# EAGLE design module_Rn_reg (EAGLE 6.5.0)

## Sheet 1 of 6
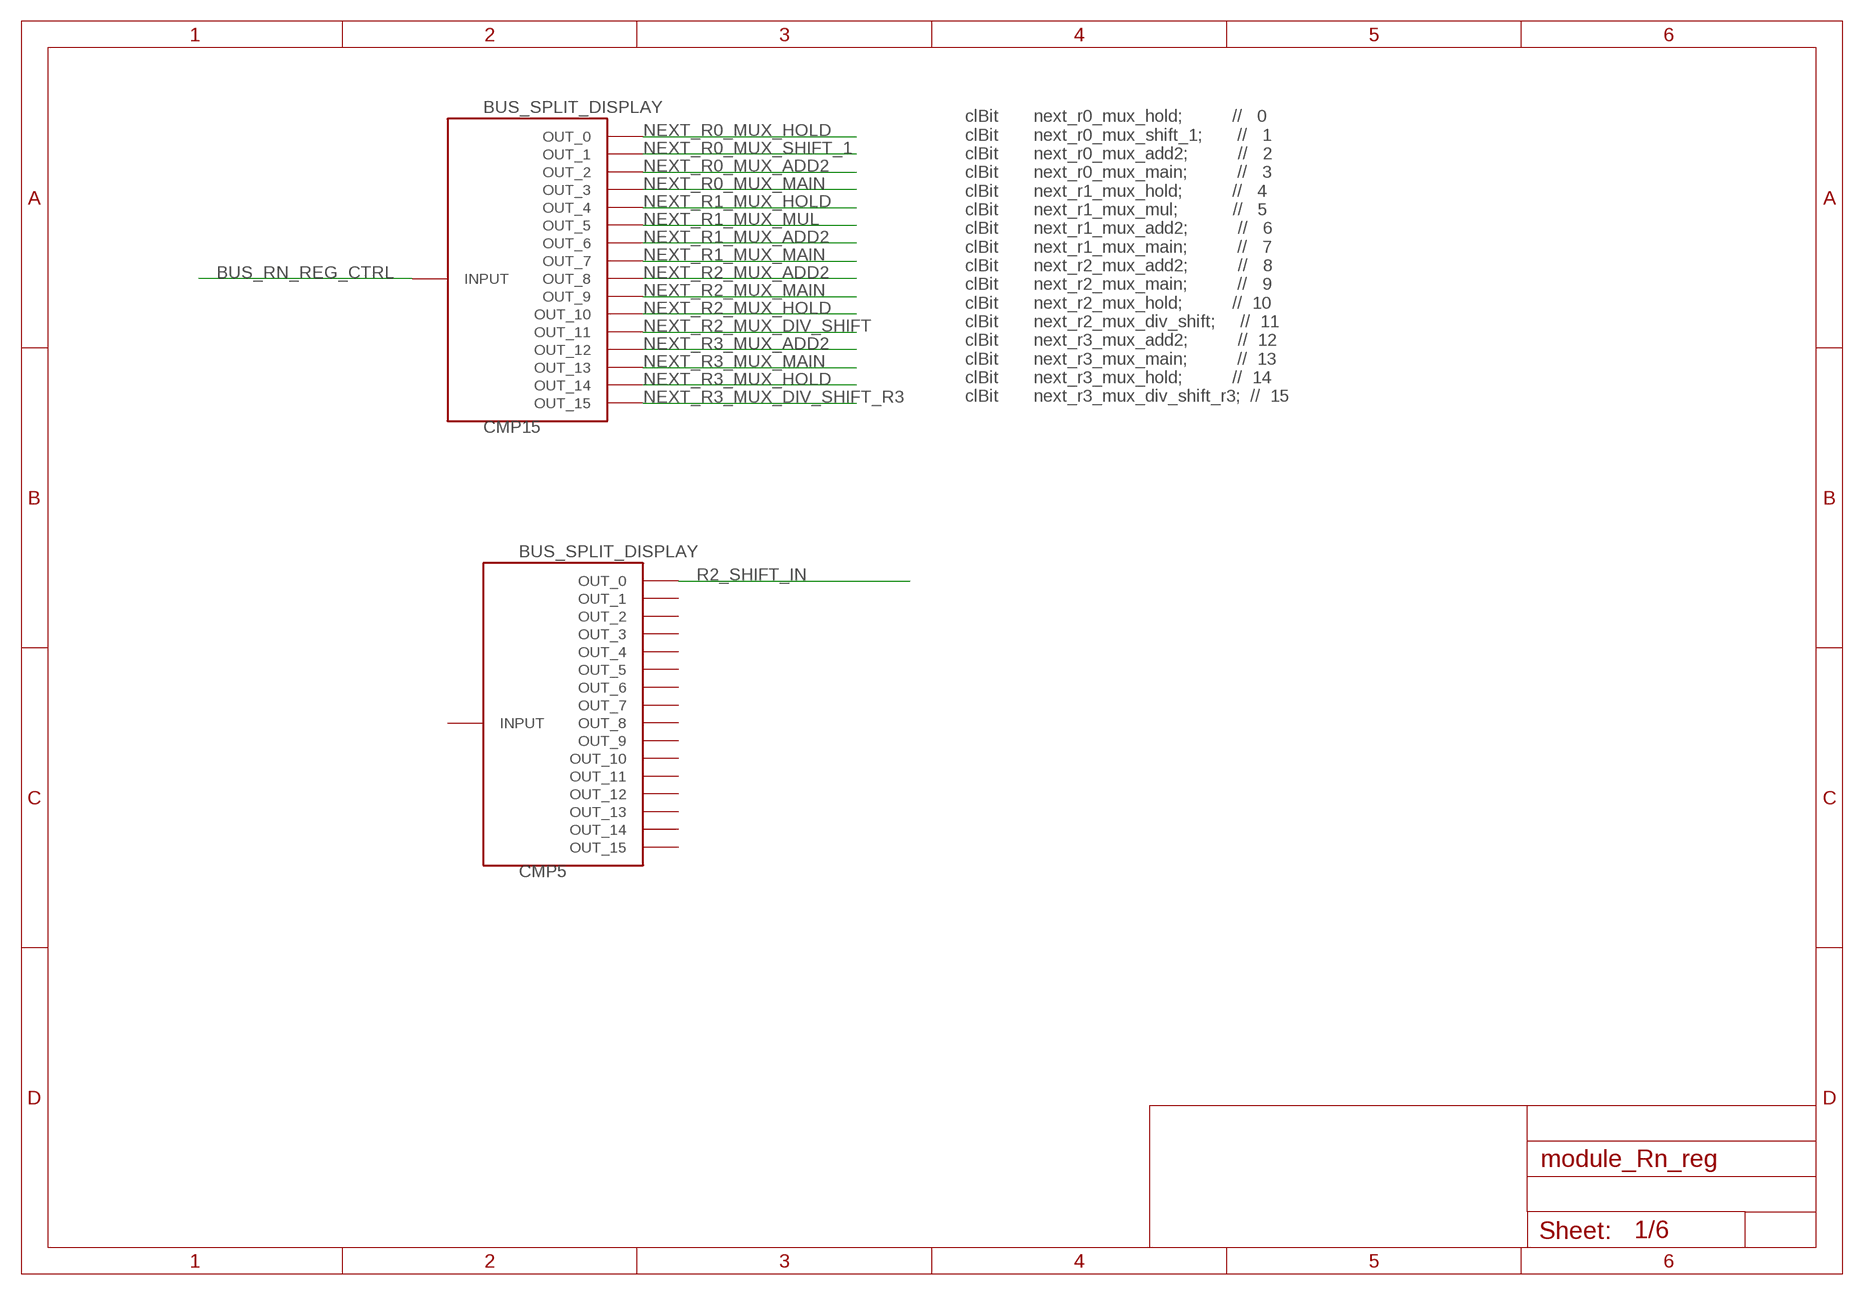
[diagram p0: schematic, sheet 1]

### Parts
CMP5  BUS_SPLIT_DISPLAY  [BUS_SPLIT_DISPLAY]
CMP15  BUS_SPLIT_DISPLAY  [BUS_SPLIT_DISPLAY]

### Nets
BUS_RN_REG_CTRL: CMP15.INPUT
NEXT_R0_MUX_ADD2: CMP15.P$3(OUT_2) ; also sheet 3
NEXT_R0_MUX_HOLD: CMP15.P$1(OUT_0) ; also sheet 3
NEXT_R0_MUX_MAIN: CMP15.P$4(OUT_3) ; also sheet 3
NEXT_R0_MUX_SHIFT_1: CMP15.P$2(OUT_1) ; also sheet 3
NEXT_R1_MUX_ADD2: CMP15.P$7(OUT_6) ; also sheet 4
NEXT_R1_MUX_HOLD: CMP15.P$5(OUT_4) ; also sheet 4
NEXT_R1_MUX_MAIN: CMP15.P$8(OUT_7) ; also sheet 4
NEXT_R1_MUX_MUL: CMP15.P$6(OUT_5) ; also sheet 4
NEXT_R2_MUX_ADD2: CMP15.P$9(OUT_8) ; also sheet 5
NEXT_R2_MUX_DIV_SHIFT: CMP15.P$12(OUT_11) ; also sheet 5
NEXT_R2_MUX_HOLD: CMP15.P$11(OUT_10) ; also sheet 5
NEXT_R2_MUX_MAIN: CMP15.P$10(OUT_9) ; also sheet 5
NEXT_R3_MUX_ADD2: CMP15.P$13(OUT_12) ; also sheet 6
NEXT_R3_MUX_DIV_SHIFT_R3: CMP15.P$16(OUT_15) ; also sheet 6
NEXT_R3_MUX_HOLD: CMP15.P$15(OUT_14) ; also sheet 6
NEXT_R3_MUX_MAIN: CMP15.P$14(OUT_13) ; also sheet 6
R2_SHIFT_IN: CMP5.P$1(OUT_0) ; also sheet 5
Unconnected: CMP5.INPUT CMP5.P$2(OUT_1) CMP5.P$3(OUT_2) CMP5.P$4(OUT_3) CMP5.P$5(OUT_4) CMP5.P$6(OUT_5) CMP5.P$7(OUT_6) CMP5.P$8(OUT_7) CMP5.P$9(OUT_8) CMP5.P$10(OUT_9) CMP5.P$11(OUT_10) CMP5.P$12(OUT_11) CMP5.P$13(OUT_12) CMP5.P$14(OUT_13) CMP5.P$15(OUT_14) CMP5.P$16(OUT_15)

### Notes on the sheet
- clBit       next_r0_mux_hold;          //   0
      clBit       next_r0_mux_shift_1;       //   1
      clBit       next_r0_mux_add2;          //   2
      clBit       next_r0_mux_main;          //   3
      clBit       next_r1_mux_hold;          //   4
      clBit       next_r1_mux_mul;           //   5
      clBit       next_r1_mux_add2;          //   6
      clBit       next_r1_mux_main;          //   7
      clBit       next_r2_mux_add2;          //   8
      clBit       next_r2_mux_main;          //   9
      clBit       next_r2_mux_hold;          //  10
      clBit       next_r2_mux_div_shift;     //  11
      clBit       next_r3_mux_add2;          //  12
      clBit       next_r3_mux_main;          //  13
      clBit       next_r3_mux_hold;          //  14
      clBit       next_r3_mux_div_shift_r3;  //  15

## Sheet 2 of 6
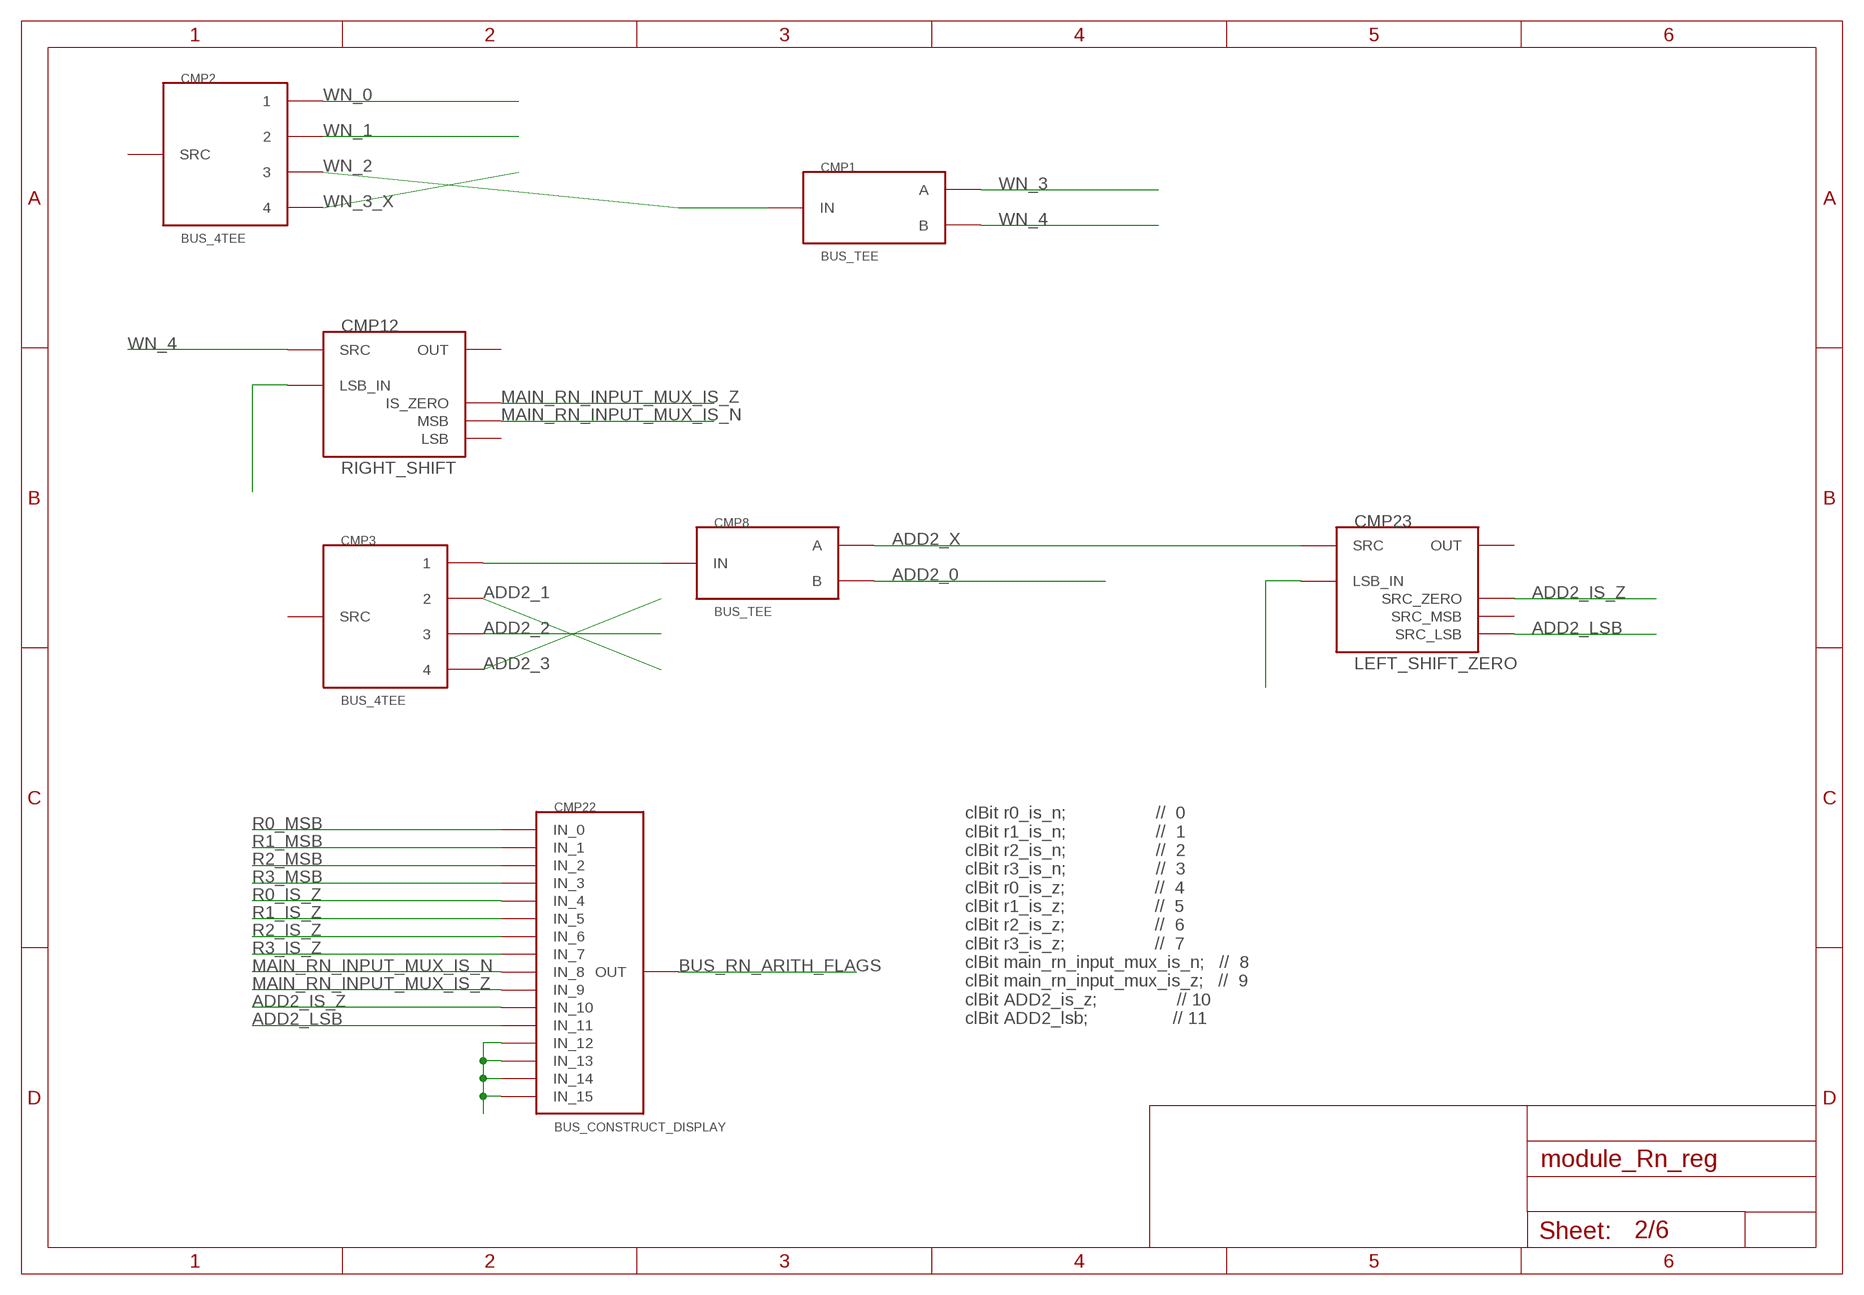
[diagram p1: schematic, sheet 2]

### Parts
CMP1  BUS_TEE  [BUS_TEE]
CMP2  BUS_4TEE  [BUS_4TEE]
CMP3  BUS_4TEE  [BUS_4TEE]
CMP8  BUS_TEE  [BUS_TEE]
CMP12  RIGHT_SHIFT  [SHIFT_ZERO]
CMP22  BUS_CONSTRUCT_DISPLAY  [BUS_SPLIT_DISPLAY]
CMP23  LEFT_SHIFT_ZERO  [SHIFT_ZERO]

### Nets
ADD2_0: CMP8.OUTB(B) ; also sheet 3
ADD2_1: CMP3.4 ; also sheet 4
ADD2_2: CMP3.3 ; also sheet 5
ADD2_3: CMP3.2 ; also sheet 6
ADD2_IS_Z: CMP22.P$11(IN_10) CMP23.IS_ZERO(SRC_ZERO)
ADD2_LSB: CMP22.P$12(IN_11) CMP23.LSB(SRC_LSB)
ADD2_X: CMP8.OUT_A(A) CMP23.LSRC(SRC)
BUS_RN_ARITH_FLAGS: CMP22.INPUT(OUT)
MAIN_RN_INPUT_MUX_IS_N: CMP12.MSB CMP22.P$9(IN_8)
MAIN_RN_INPUT_MUX_IS_Z: CMP12.IS_ZERO CMP22.P$10(IN_9)
N$2: CMP22.P$13(IN_12) CMP22.P$14(IN_13) CMP22.P$15(IN_14) CMP22.P$16(IN_15)
N$8: CMP3.1 CMP8.INPUT(IN)
N$9: CMP23.SHIFT_IN(LSB_IN)
N$10: CMP12.SHIFT_IN(LSB_IN)
R0_IS_Z: CMP22.P$5(IN_4) ; also sheet 3
R0_MSB: CMP22.P$1(IN_0) ; also sheet 3
R1_IS_Z: CMP22.P$6(IN_5) ; also sheet 4
R1_MSB: CMP22.P$2(IN_1) ; also sheet 4
R2_IS_Z: CMP22.P$7(IN_6) ; also sheet 5
R2_MSB: CMP22.P$3(IN_2) ; also sheet 5,6
R3_IS_Z: CMP22.P$8(IN_7) ; also sheet 6
R3_MSB: CMP22.P$4(IN_3) ; also sheet 6
WN_0: CMP2.1 ; also sheet 3
WN_1: CMP2.2 ; also sheet 4
WN_2: CMP2.4 ; also sheet 5
WN_3: CMP1.OUT_A(A) ; also sheet 6
WN_3_X: CMP1.INPUT(IN) CMP2.3
WN_4: CMP1.OUTB(B) CMP12.RSRC(SRC)
Unconnected: CMP2.SRC CMP3.SRC CMP12.LSB CMP12.LSRC(OUT) CMP23.MSB(SRC_MSB) CMP23.RSRC(OUT)

### Notes on the sheet
- clBit r0_is_n;                  //  0
      clBit r1_is_n;                  //  1
      clBit r2_is_n;                  //  2
      clBit r3_is_n;                  //  3
      clBit r0_is_z;                  //  4
      clBit r1_is_z;                  //  5
      clBit r2_is_z;                  //  6
      clBit r3_is_z;                  //  7
      clBit main_rn_input_mux_is_n;   //  8 
      clBit main_rn_input_mux_is_z;   //  9
      clBit ADD2_is_z;                // 10
      clBit ADD2_lsb;                 // 11

## Sheet 3 of 6
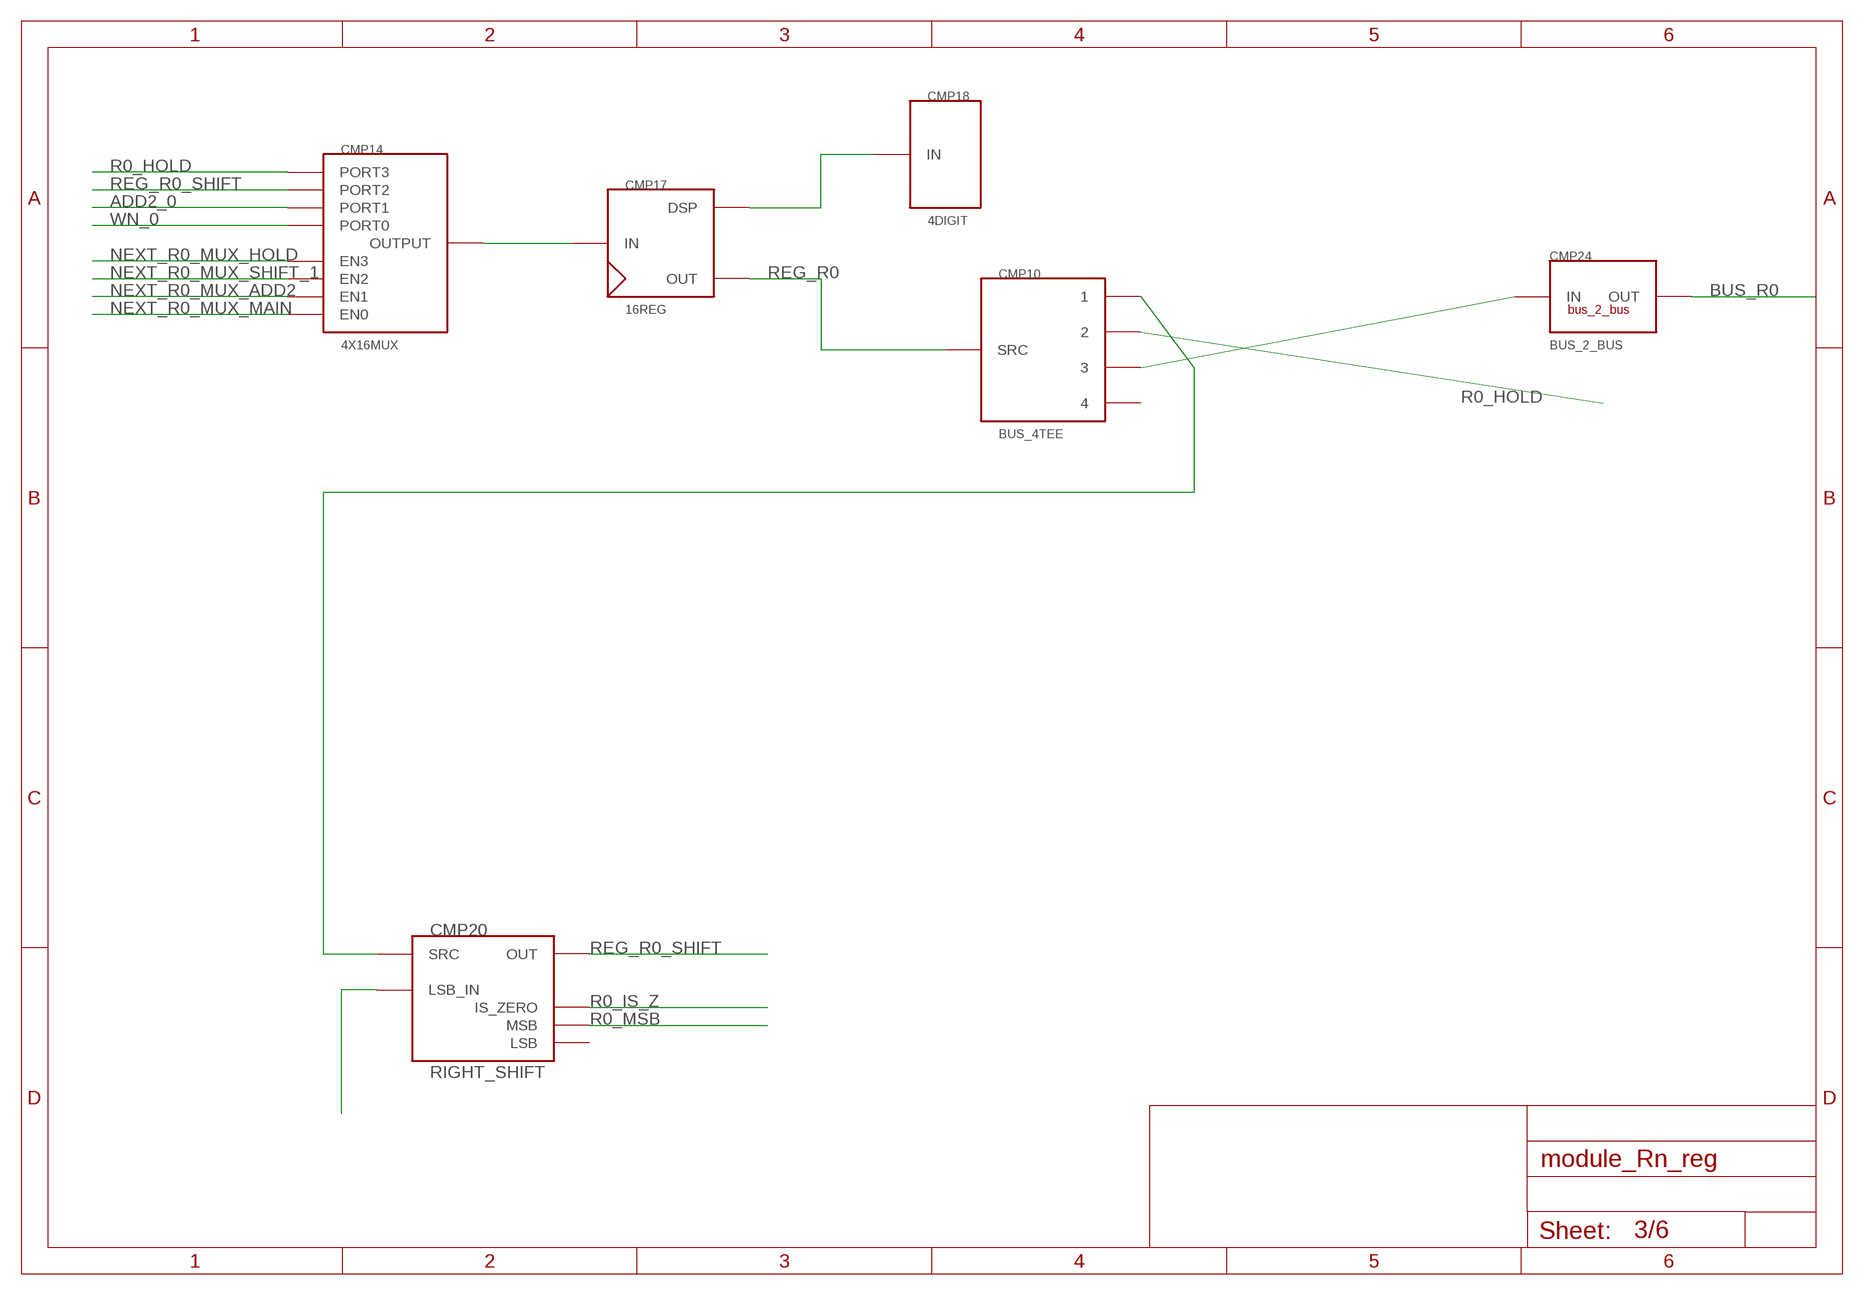
[diagram p2: schematic, sheet 3]

### Parts
CMP10  BUS_4TEE  [BUS_4TEE]
CMP14  4X16MUX  [4X16MUX]
CMP17  16REG  [16REG]
CMP18  4DIGIT  [4DIGIT]
CMP20  RIGHT_SHIFT  [SHIFT_ZERO]
CMP24  BUS_2_BUS  [BUS2BUS]

### Nets
ADD2_0: CMP14.PORT1 ; also sheet 2
BUS_R0: CMP24.P$2(OUT)
N$11: CMP20.SHIFT_IN(LSB_IN)
N$15: CMP14.PORTOUT(OUTPUT) CMP17.INPUT(IN)
N$16: CMP17.DISPLAY(DSP) CMP18.P$1(IN)
N$20: CMP10.1 CMP20.RSRC(SRC)
N$25: CMP10.3 CMP24.P$1(IN)
NEXT_R0_MUX_ADD2: CMP14.EN1 ; also sheet 1
NEXT_R0_MUX_HOLD: CMP14.EN3 ; also sheet 1
NEXT_R0_MUX_MAIN: CMP14.EN0 ; also sheet 1
NEXT_R0_MUX_SHIFT_1: CMP14.EN2 ; also sheet 1
R0_HOLD: CMP10.2 CMP14.PORT3
R0_IS_Z: CMP20.IS_ZERO ; also sheet 2
R0_MSB: CMP20.MSB ; also sheet 2
REG_R0: CMP10.SRC CMP17.OUT
REG_R0_SHIFT: CMP14.PORT2 CMP20.LSRC(OUT)
WN_0: CMP14.PORT0 ; also sheet 2
Unconnected: CMP10.4 CMP20.LSB

## Sheet 4 of 6
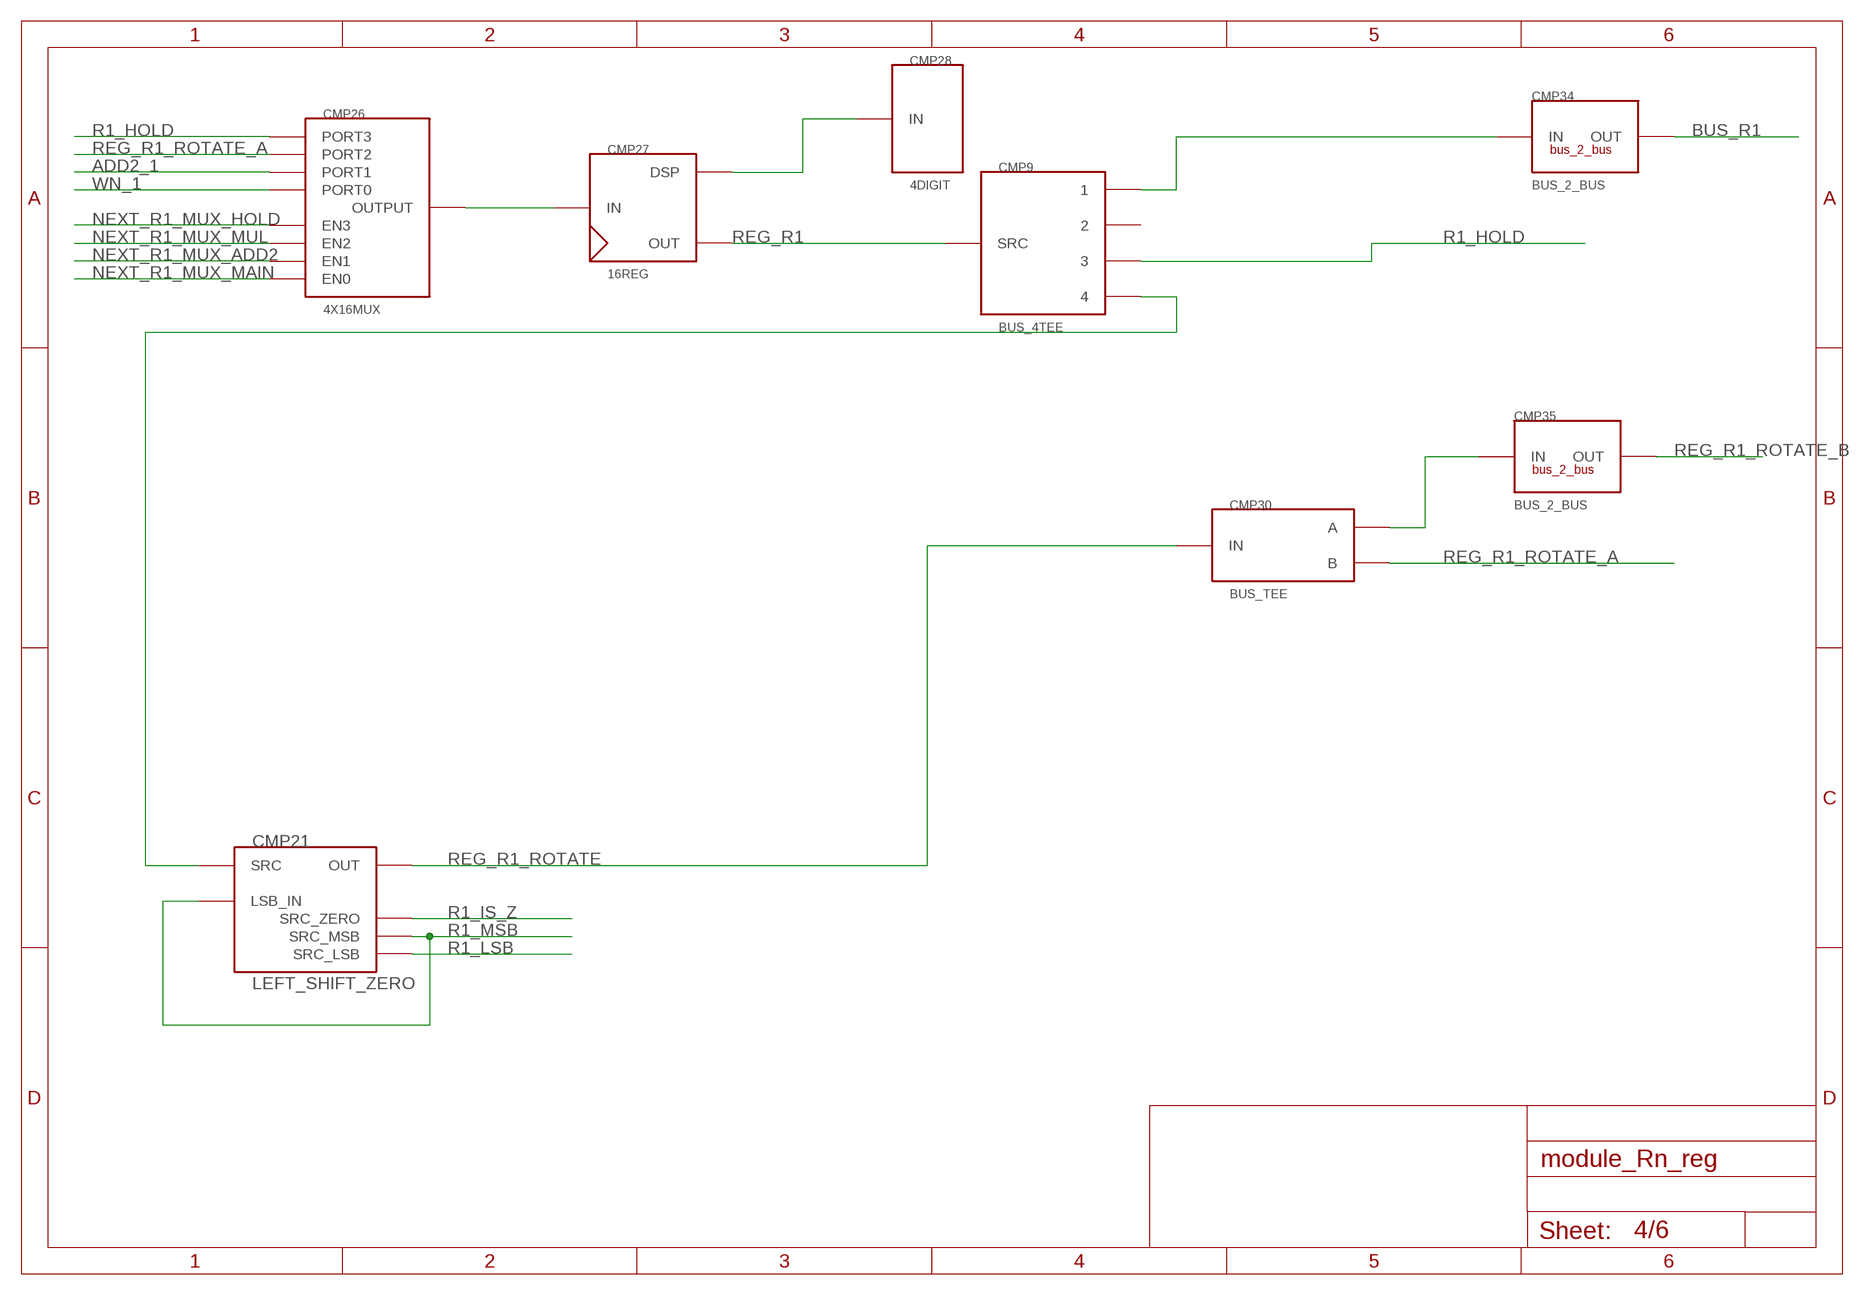
[diagram p3: schematic, sheet 4]

### Parts
CMP9  BUS_4TEE  [BUS_4TEE]
CMP21  LEFT_SHIFT_ZERO  [SHIFT_ZERO]
CMP26  4X16MUX  [4X16MUX]
CMP27  16REG  [16REG]
CMP28  4DIGIT  [4DIGIT]
CMP30  BUS_TEE  [BUS_TEE]
CMP34  BUS_2_BUS  [BUS2BUS]
CMP35  BUS_2_BUS  [BUS2BUS]

### Nets
ADD2_1: CMP26.PORT1 ; also sheet 2
BUS_R1: CMP34.P$2(OUT)
N$1: CMP26.PORTOUT(OUTPUT) CMP27.INPUT(IN)
N$3: CMP27.DISPLAY(DSP) CMP28.P$1(IN)
N$5: CMP9.1 CMP34.P$1(IN)
N$12: CMP9.4 CMP21.LSRC(SRC)
N$13: CMP30.OUT_A(A) CMP35.P$1(IN)
NEXT_R1_MUX_ADD2: CMP26.EN1 ; also sheet 1
NEXT_R1_MUX_HOLD: CMP26.EN3 ; also sheet 1
NEXT_R1_MUX_MAIN: CMP26.EN0 ; also sheet 1
NEXT_R1_MUX_MUL: CMP26.EN2 ; also sheet 1
R1_HOLD: CMP9.3 CMP26.PORT3
R1_IS_Z: CMP21.IS_ZERO(SRC_ZERO) ; also sheet 2
R1_LSB: CMP21.LSB(SRC_LSB)
R1_MSB: CMP21.MSB(SRC_MSB) CMP21.SHIFT_IN(LSB_IN) ; also sheet 2
REG_R1: CMP9.SRC CMP27.OUT
REG_R1_ROTATE: CMP21.RSRC(OUT) CMP30.INPUT(IN)
REG_R1_ROTATE_A: CMP26.PORT2 CMP30.OUTB(B)
REG_R1_ROTATE_B: CMP35.P$2(OUT)
WN_1: CMP26.PORT0 ; also sheet 2
Unconnected: CMP9.2

## Sheet 5 of 6
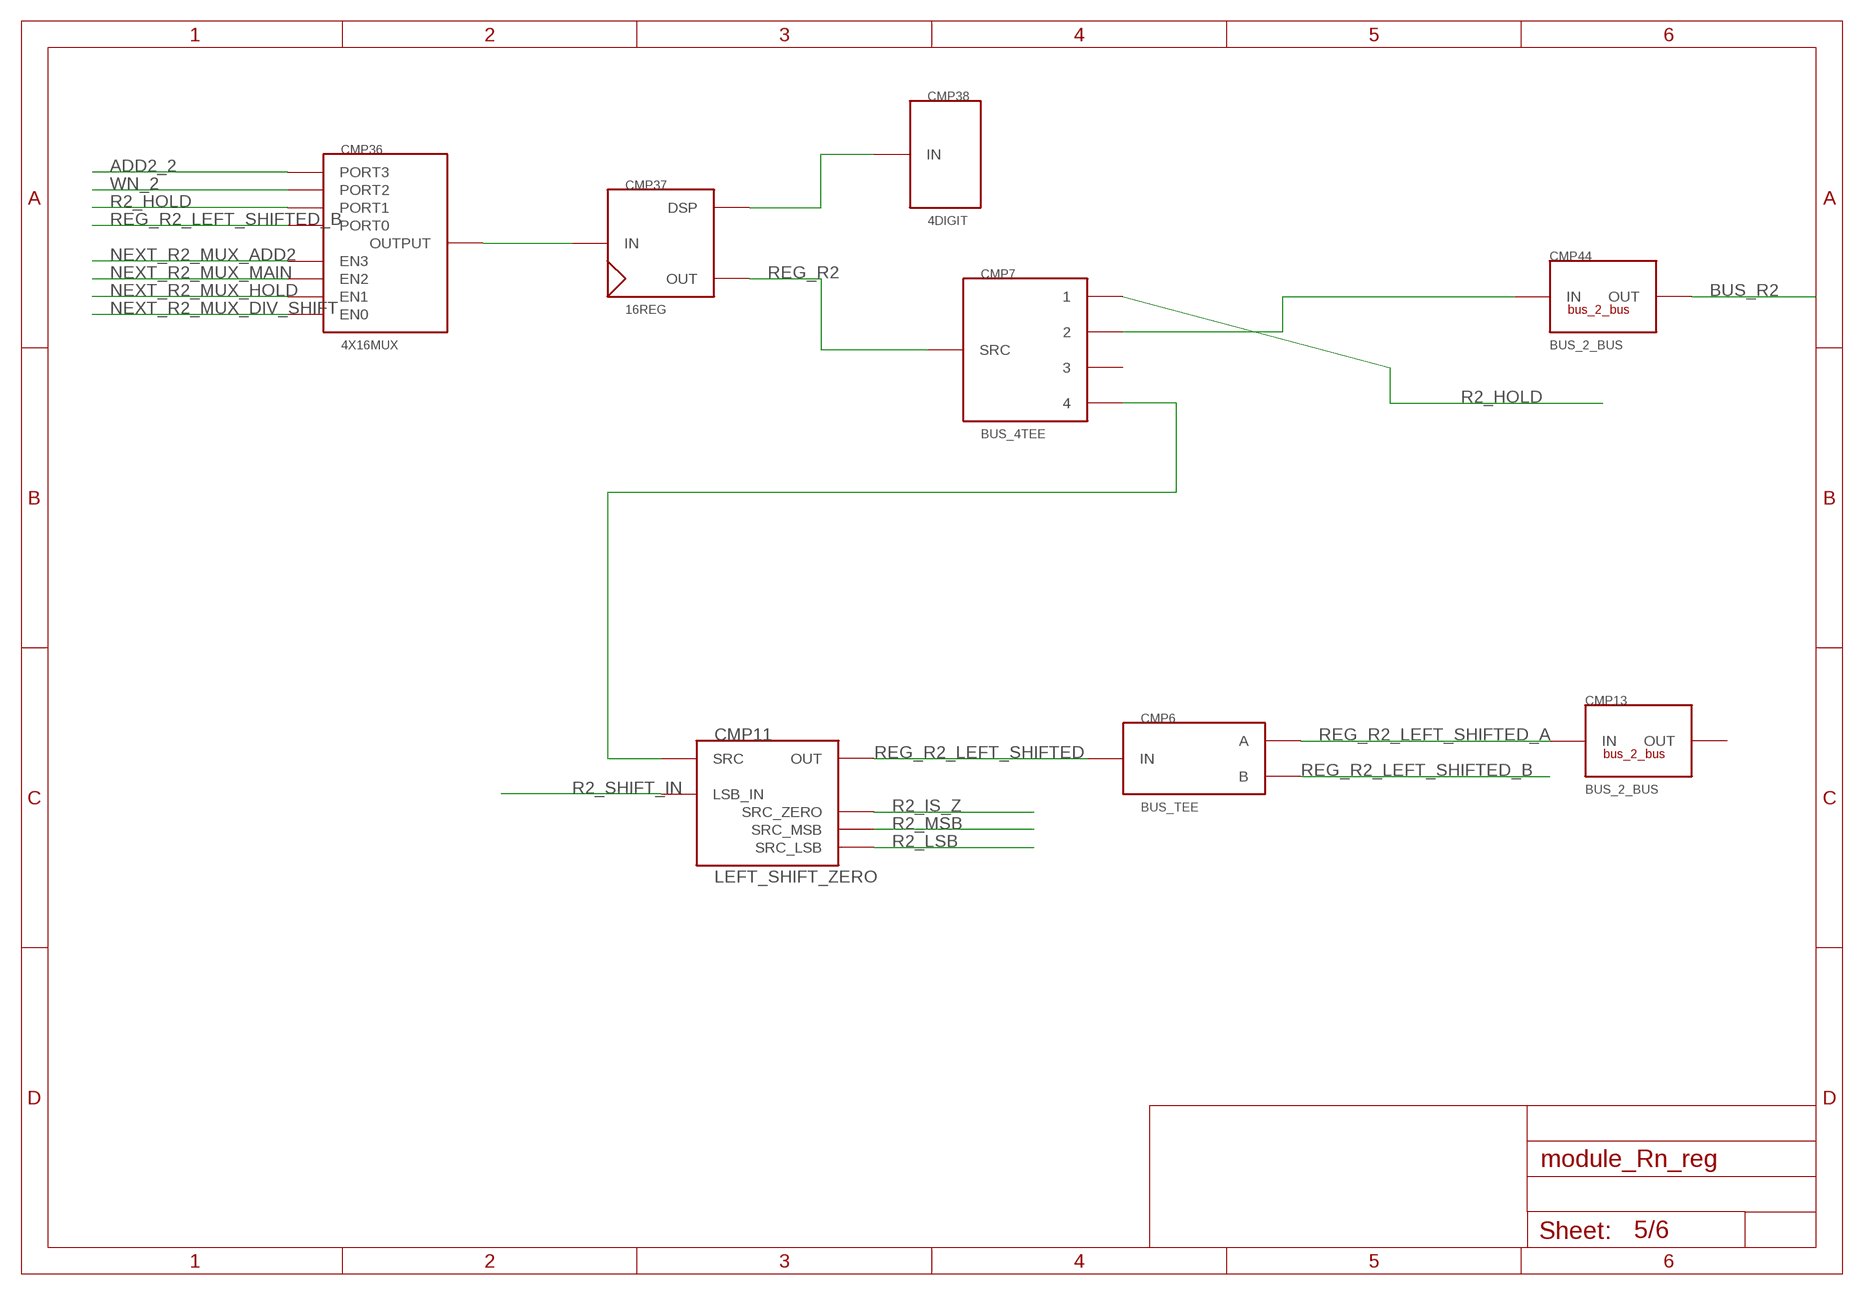
[diagram p4: schematic, sheet 5]

### Parts
CMP6  BUS_TEE  [BUS_TEE]
CMP7  BUS_4TEE  [BUS_4TEE]
CMP11  LEFT_SHIFT_ZERO  [SHIFT_ZERO]
CMP13  BUS_2_BUS  [BUS2BUS]
CMP36  4X16MUX  [4X16MUX]
CMP37  16REG  [16REG]
CMP38  4DIGIT  [4DIGIT]
CMP44  BUS_2_BUS  [BUS2BUS]

### Nets
ADD2_2: CMP36.PORT3 ; also sheet 2
BUS_R2: CMP44.P$2(OUT)
N$6: CMP7.2 CMP44.P$1(IN)
N$14: CMP36.PORTOUT(OUTPUT) CMP37.INPUT(IN)
N$27: CMP37.DISPLAY(DSP) CMP38.P$1(IN)
N$44: CMP7.4 CMP11.LSRC(SRC)
NEXT_R2_MUX_ADD2: CMP36.EN3 ; also sheet 1
NEXT_R2_MUX_DIV_SHIFT: CMP36.EN0 ; also sheet 1
NEXT_R2_MUX_HOLD: CMP36.EN1 ; also sheet 1
NEXT_R2_MUX_MAIN: CMP36.EN2 ; also sheet 1
R2_HOLD: CMP7.1 CMP36.PORT1
R2_IS_Z: CMP11.IS_ZERO(SRC_ZERO) ; also sheet 2
R2_LSB: CMP11.LSB(SRC_LSB)
R2_MSB: CMP11.MSB(SRC_MSB) ; also sheet 2,6
R2_SHIFT_IN: CMP11.SHIFT_IN(LSB_IN) ; also sheet 1
REG_R2: CMP7.SRC CMP37.OUT
REG_R2_LEFT_SHIFTED: CMP6.INPUT(IN) CMP11.RSRC(OUT)
REG_R2_LEFT_SHIFTED_A: CMP6.OUT_A(A) CMP13.P$1(IN)
REG_R2_LEFT_SHIFTED_B: CMP6.OUTB(B) CMP36.PORT0
WN_2: CMP36.PORT2 ; also sheet 2
Unconnected: CMP7.3 CMP13.P$2(OUT)

## Sheet 6 of 6
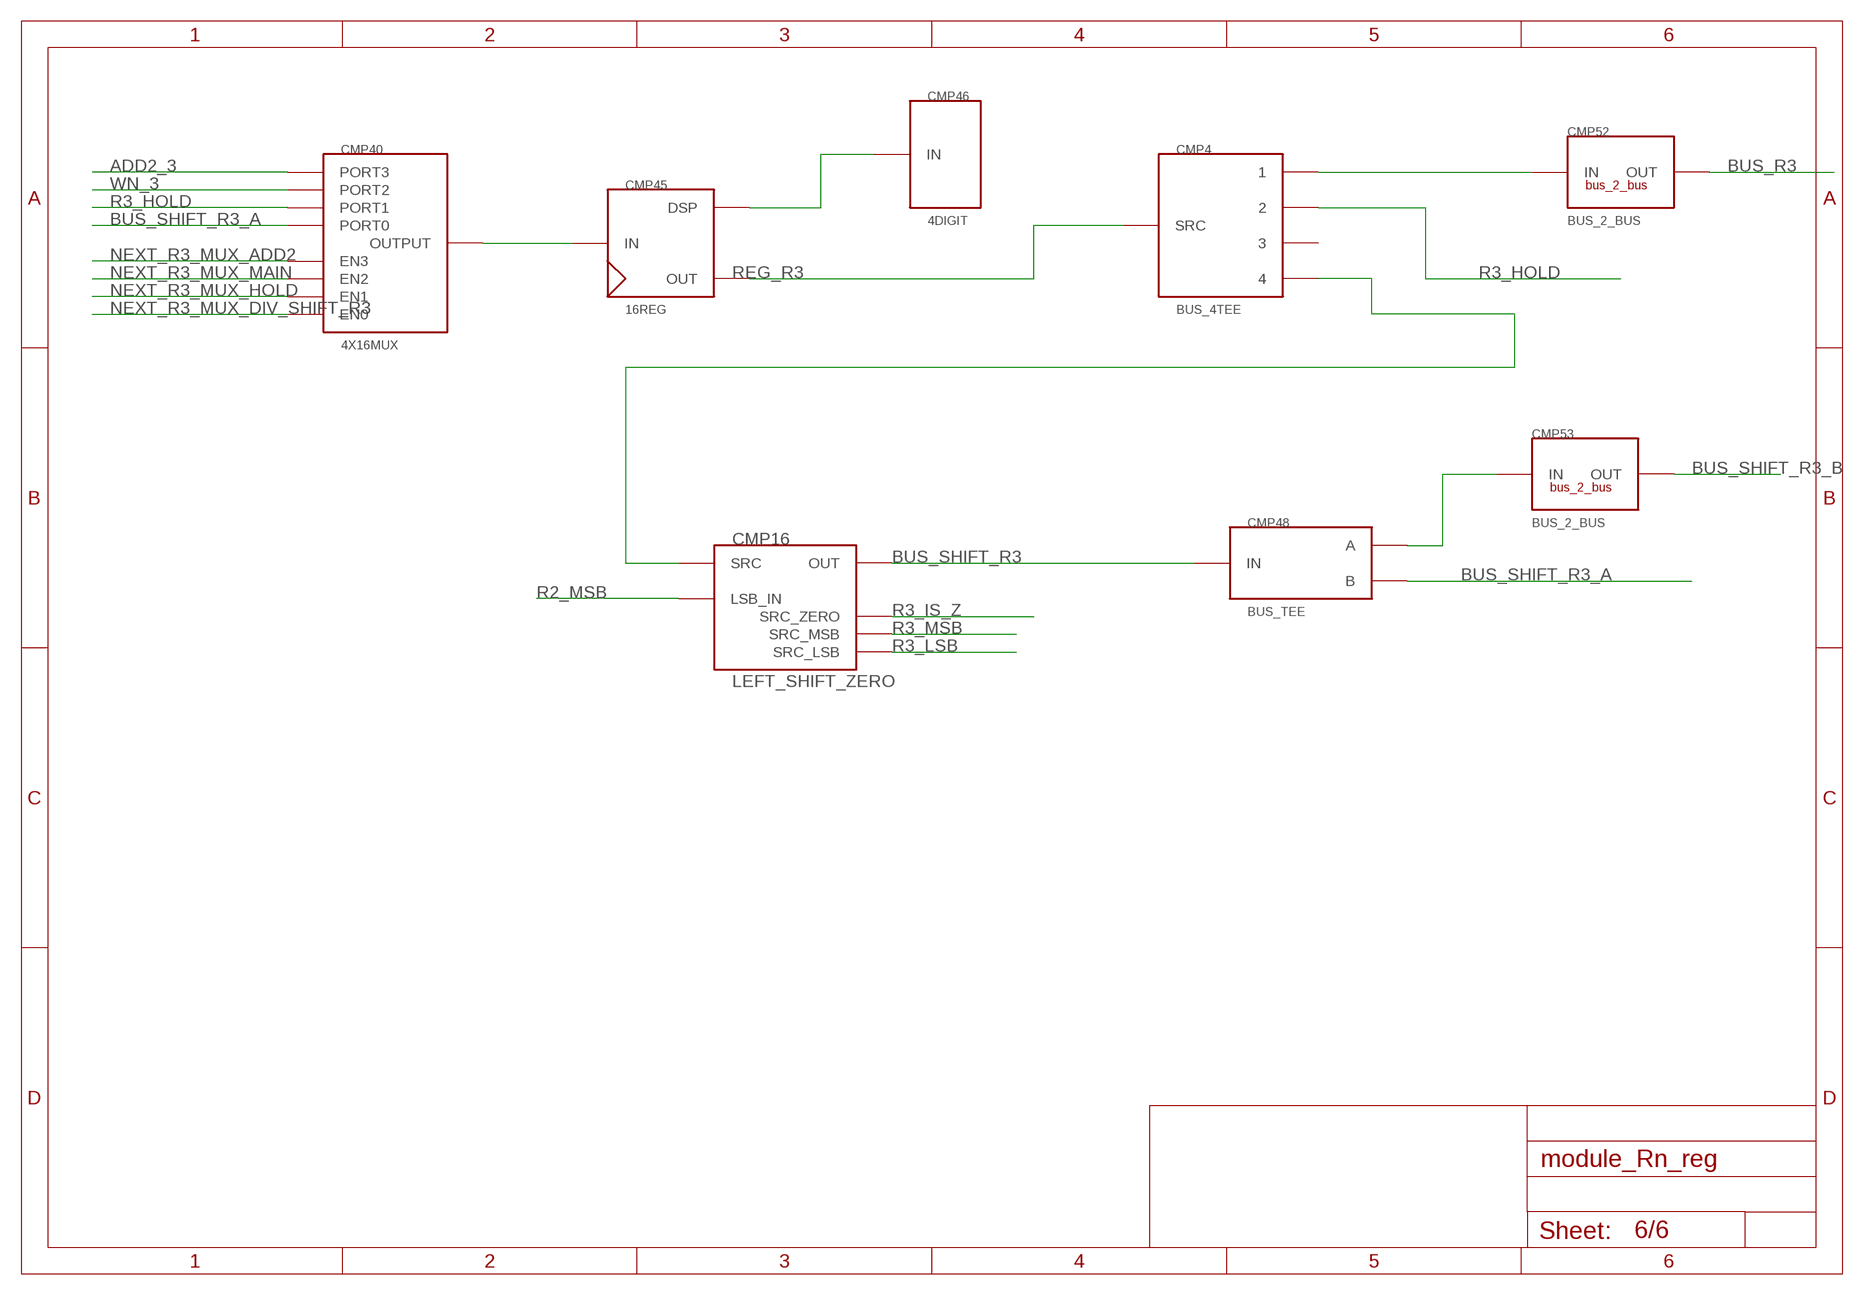
[diagram p5: schematic, sheet 6]

### Parts
CMP4  BUS_4TEE  [BUS_4TEE]
CMP16  LEFT_SHIFT_ZERO  [SHIFT_ZERO]
CMP40  4X16MUX  [4X16MUX]
CMP45  16REG  [16REG]
CMP46  4DIGIT  [4DIGIT]
CMP48  BUS_TEE  [BUS_TEE]
CMP52  BUS_2_BUS  [BUS2BUS]
CMP53  BUS_2_BUS  [BUS2BUS]

### Nets
ADD2_3: CMP40.PORT3 ; also sheet 2
BUS_R3: CMP52.P$2(OUT)
BUS_SHIFT_R3: CMP16.RSRC(OUT) CMP48.INPUT(IN)
BUS_SHIFT_R3_A: CMP40.PORT0 CMP48.OUTB(B)
BUS_SHIFT_R3_B: CMP53.P$2(OUT)
N$4: CMP4.1 CMP52.P$1(IN)
N$45: CMP40.PORTOUT(OUTPUT) CMP45.INPUT(IN)
N$46: CMP45.DISPLAY(DSP) CMP46.P$1(IN)
N$50: CMP4.4 CMP16.LSRC(SRC)
N$51: CMP48.OUT_A(A) CMP53.P$1(IN)
NEXT_R3_MUX_ADD2: CMP40.EN3 ; also sheet 1
NEXT_R3_MUX_DIV_SHIFT_R3: CMP40.EN0 ; also sheet 1
NEXT_R3_MUX_HOLD: CMP40.EN1 ; also sheet 1
NEXT_R3_MUX_MAIN: CMP40.EN2 ; also sheet 1
R2_MSB: CMP16.SHIFT_IN(LSB_IN) ; also sheet 2,5
R3_HOLD: CMP4.2 CMP40.PORT1
R3_IS_Z: CMP16.IS_ZERO(SRC_ZERO) ; also sheet 2
R3_LSB: CMP16.LSB(SRC_LSB)
R3_MSB: CMP16.MSB(SRC_MSB) ; also sheet 2
REG_R3: CMP4.SRC CMP45.OUT
WN_3: CMP40.PORT2 ; also sheet 2
Unconnected: CMP4.3

## Library data of the parts
CMP1 CMP6 CMP8 CMP30 CMP48 = modules:BUS_TEE
CMP2-CMP4 CMP7 CMP9 CMP10 = modules:BUS_4TEE
CMP5 CMP15 = modules:BUS_SPLIT_DISPLAY
CMP11 CMP16 CMP21 CMP23 = modules:LEFT_SHIFT_ZERO
CMP12 CMP20 = modules:RIGHT_SHIFT
CMP13 CMP24 CMP34 CMP35 CMP44 CMP52 CMP53 = modules:BUS_2_BUS
CMP14 CMP26 CMP36 CMP40 = modules:4X16MUX
CMP17 CMP27 CMP37 CMP45 = modules:16REG
CMP18 CMP28 CMP38 CMP46 = modules:4DIGIT
CMP22 = modules:BUS_CONSTRUCT_DISPLAY

## Board
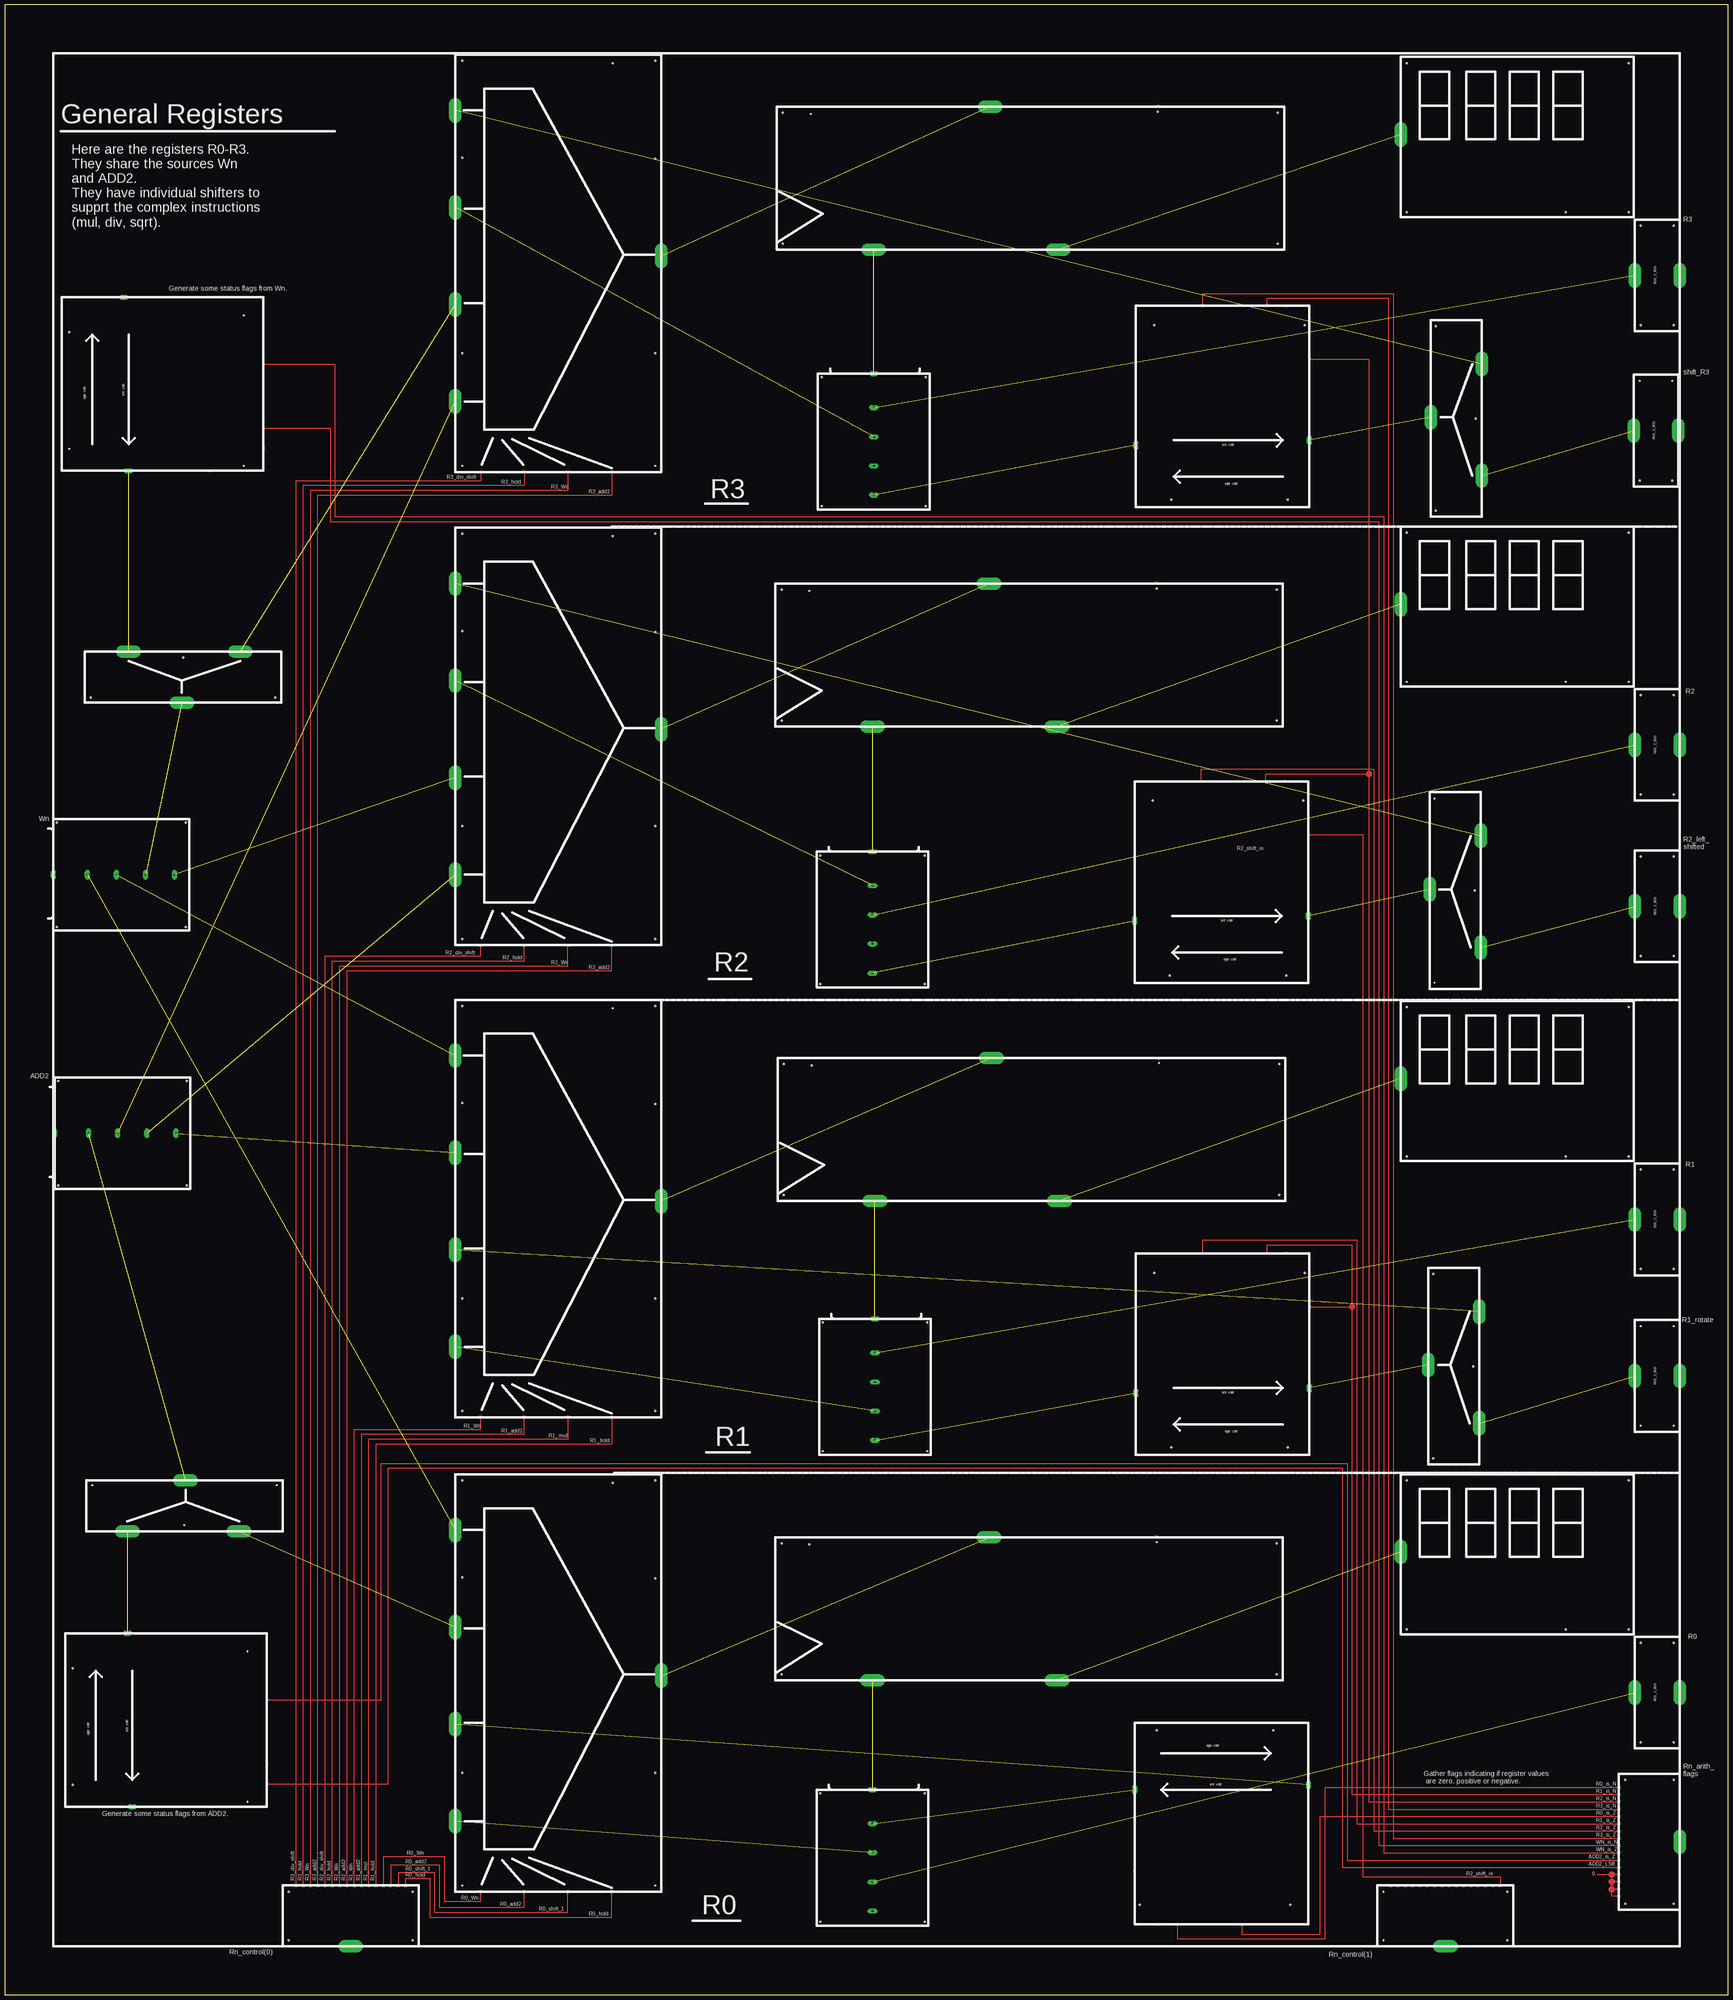
[diagram p6: board, top side]

Size 901.7 x 1041.4 mm. Coordinates in mm from the lower left corner, seen from the top.
Outline: 0,0 901.7,0 901.7,1041.4 0,1041.4 0,0
Copper layers (1*16): Top 0.035mm / dielectric 1.5mm / Bottom 0.035mm
Design rules "default": minimum track width 10mil, minimum drill 24mil, track to track 8mil, track to pad 8mil, pad to pad 8mil, via to via 8mil, smd to smd 8mil, copper to edge 40mil, drill to drill 8mil, minimum pad ring 10mil, minimum via ring 8mil, stop-mask expansion 4mil, vias tented up to drill 0mil, thermal gap 10mil
tKeepout: area 867.2,16.3 to 885.4,34.5; area 867.2,1006.9 to 885.4,1025.1; area 867.2,511.6 to 885.4,529.8; area 16.3,1006.9 to 34.5,1025.1; area 16.3,511.6 to 34.5,529.8; area 16.3,16.3 to 34.5,34.5

### Footprints (pad centres in the part's own frame; a part is rotated, then mirrored left to right if it is on the bottom)
BUS_TEE = drill 0.8 pad 6.452 long: INPUT 0,15.24; OUT_A -30.48,-11.43; OUTB 27.94,-11.43 | hole 0.6: -48.895,12.7; -0.635,-8.255; 47.625,12.7
BUS_4TEE = drill 0.8 pad 2.54 long: 1 2.54,12.7; 2 2.54,-2.54; 3 2.54,-17.78; 4 2.54,-33.02; SRC 2.54,30.48 | hole 0.6: -24.765,28.575; 29.845,28.575; 29.845,-38.735; -24.765,-38.735
BUS_SPLIT_DISPLAY = drill 0.8 pad 6.452 long: INPUT 0,15.24 | drill 0.8 square: P$1 -28.575,-16.51; P$2 -24.765,-16.51; P$3 -20.955,-16.51; P$4 -17.145,-16.51; P$5 -13.335,-16.51; P$6 -9.525,-16.51; P$7 -5.715,-16.51; P$8 -1.905,-16.51; P$9 1.905,-16.51; P$10 5.715,-16.51; P$11 9.525,-16.51; P$12 13.335,-16.51; P$13 17.145,-16.51; P$14 20.955,-16.51; P$15 24.765,-16.51; P$16 28.575,-16.51 | hole 0.6: -32.385,-13.335; -32.385,12.065; 32.385,12.065; 32.385,-13.335
SHIFT_ZERO = drill 0.8 pad 1.27: IS_ZERO 105.41,55.88; LSB 105.41,12.065; MSB 105.41,22.225; SHIFT_IN 77.47,0 | drill 0.8 pad 2.54 long: LSRC 32.385,90.805; RSRC 34.925,0 | hole 0.6: 3.81,11.43; 3.81,72.39; 95.25,2.54; 95.25,81.28
BUS2BUS = drill 0.8 pad 6.452 long: P$1 -1.27,12.7; P$2 -1.27,-10.795 | hole 0.6: -27.305,-7.62; -27.305,9.525; 24.765,9.525; 24.765,-7.62
4X16MUX = drill 0.8 square: EN0 -113.03,38.735; EN1 -113.03,15.875; EN2 -113.03,-6.985; EN3 -113.03,-29.845 | drill 0.8 pad 6.452 long: PORT0 76.2,52.07; PORT1 25.4,52.07; PORT2 -25.4,52.07; PORT3 -76.2,52.07; PORTOUT 0,-55.88 | hole 0.6: -109.855,-52.705; -50.8,-52.705; 50.8,-52.705; 102.235,-52.705; 102.235,48.26; 51.435,48.26; -50.8,48.26; -109.855,48.26; 100.965,-30.48
16REG = drill 0.8 pad 6.452 long: DISPLAY 17.78,-33.02; INPUT -17.78,41.91; OUT -78.74,-33.02 | drill 0.8 square: P$1 69.85,41.91 | hole 0.6: -126.365,-29.845; -126.365,38.735; 132.715,38.735; 132.715,-29.845; -111.76,38.1; 69.85,39.37
4DIGIT = drill 0.8 pad 6.452 long: P$1 -57.15,1.27 | hole 0.6: 29.21,-39.37; 62.23,-39.37; 62.23,38.735; -53.975,38.735; -53.975,-39.37

### Placement (x,y rotation side)
CMP1  92.71,691.51 180 top
CMP2  55.88,583.57 90 top
CMP3  56.52,448.31 90 top
CMP4  452.12,817.88 0 top
CMP5  753.75,40.64 180 top
CMP6  760.73,578.49 90 top
CMP7  451.49,567.69 0 top
CMP8  94.61,254 0 top
CMP9  452.75,323.21 0 top
CMP10  451.49,76.83 0 top
CMP11  681.99,529.59 90 top
CMP12  29.84,797.56 0 top
CMP13  865.5,570.87 90 top
CMP14  287.65,167 90 top
CMP15  180.97,40.64 180 top
CMP16  682.62,778.51 90 top
CMP17  532.76,197.49 0 top
CMP18  787.4,230.5 0 top
CMP20  591.18,142.24 270 top
CMP21  682.62,282.57 90 top
CMP22  861.06,80.01 270 top
CMP23  31.75,98.42 0 top
CMP24  865.5,159.38 90 top
CMP26  287.65,415.29 90 top
CMP27  534.03,448.31 0 top
CMP28  787.4,478.15 0 top
CMP30  760.1,329.56 90 top
CMP34  865.5,407.04 90 top
CMP35  865.5,325.12 90 top
CMP36  287.65,662.3 90 top
CMP37  532.76,696.6 0 top
CMP38  787.4,726.44 0 top
CMP40  287.65,909.96 90 top
CMP44  865.5,655.32 90 top
CMP45  533.4,946.15 0 top
CMP46  787.4,972.18 0 top
CMP48  761.37,825.5 90 top
CMP52  865.5,901.07 90 top
CMP53  864.87,819.78 90 top

### Tracks (layer width: path | path; a pad name or v marks a point on that pad's centre or on a via)
ADD2_0  (1 unrouted)
ADD2_1  (1 unrouted)
ADD2_2  (1 unrouted)
ADD2_3  (1 unrouted)
ADD2_IS_Z
  Top 0.61: CMP23.IS_ZERO 196.85,154.31 196.85,278.13 702.31,278.13 702.31,70.48 CMP22.P$11
ADD2_LSB
  Top 0.61: CMP23.LSB 200.66,110.49 200.66,275.59 699.77,275.59 699.77,66.67 CMP22.P$12
ADD2_X  (1 unrouted)
BUS_SHIFT_R3  (1 unrouted)
BUS_SHIFT_R3_A  (1 unrouted)
MAIN_RN_INPUT_MUX_IS_N
  Top 0.61: CMP12.MSB 170.18,819.78 170.18,770.89 718.82,770.89 718.82,78.11 CMP22.P$9
MAIN_RN_INPUT_MUX_IS_Z
  Top 0.61: CMP12.IS_ZERO 172.72,853.44 172.72,773.43 721.36,773.43 721.36,74.3 CMP22.P$10
N$1  (1 unrouted)
N$2
  Top 0.61: CMP22.P$13 840.74,62.87 | 840.74,62.87 833.12,62.87 | CMP22.P$16 840.74,51.44 840.74,55.24 | 840.74,55.24 840.74,59.05 | 840.74,59.05 840.74,62.87 | CMP22.P$14 840.74,59.05 | CMP22.P$15 840.74,55.24
N$3  (1 unrouted)
N$4  (1 unrouted)
N$5  (1 unrouted)
N$6  (1 unrouted)
N$8  (1 unrouted)
N$12  (1 unrouted)
N$13  (1 unrouted)
N$14  (1 unrouted)
N$15  (1 unrouted)
N$16  (1 unrouted)
N$20  (1 unrouted)
N$25  (1 unrouted)
N$27  (1 unrouted)
N$44  (1 unrouted)
N$45  (1 unrouted)
N$46  (1 unrouted)
N$50  (1 unrouted)
N$51  (1 unrouted)
NEXT_R0_MUX_ADD2
  Top 0.61: CMP15.P$3 201.93,67.94 227.33,67.94 227.33,45.72 271.78,45.72 CMP14.EN1
NEXT_R0_MUX_HOLD
  Top 0.61: CMP15.P$1 209.55,60.96 222.25,60.96 222.25,40.64 317.5,40.64 CMP14.EN3
NEXT_R0_MUX_MAIN
  Top 0.61: CMP15.P$4 198.12,72.39 229.87,72.39 229.87,48.9 248.92,48.9 CMP14.EN0
NEXT_R0_MUX_SHIFT_1
  Top 0.61: CMP15.P$2 205.74,64.14 224.79,64.14 224.79,43.18 294.64,43.18 CMP14.EN2
NEXT_R1_MUX_ADD2
  Top 0.61: CMP15.P$7 186.69,293.37 271.78,293.37 CMP26.EN1
NEXT_R1_MUX_HOLD
  Top 0.61: CMP15.P$5 194.31,288.29 317.5,288.29 CMP26.EN3
NEXT_R1_MUX_MAIN
  Top 0.61: CMP15.P$8 182.88,295.91 248.92,295.91 CMP26.EN0
NEXT_R1_MUX_MUL
  Top 0.61: CMP15.P$6 190.5,290.83 294.64,290.83 CMP26.EN2
NEXT_R2_MUX_ADD2
  Top 0.61: CMP15.P$9 179.07,535.94 317.5,535.94 CMP36.EN3
NEXT_R2_MUX_DIV_SHIFT
  Top 0.61: CMP15.P$12 167.64,543.56 248.92,543.56 CMP36.EN0
NEXT_R2_MUX_HOLD
  Top 0.61: CMP15.P$11 171.45,541.02 271.78,541.02 CMP36.EN1
NEXT_R2_MUX_MAIN
  Top 0.61: CMP15.P$10 175.26,538.48 294.64,538.48 CMP36.EN2
NEXT_R3_MUX_ADD2
  Top 0.61: CMP15.P$13 163.83,784.86 317.5,784.86 CMP40.EN3
NEXT_R3_MUX_DIV_SHIFT_R3
  Top 0.61: CMP15.P$16 152.4,792.48 248.92,792.48 CMP40.EN0
NEXT_R3_MUX_HOLD
  Top 0.61: CMP15.P$15 156.21,789.94 271.78,789.94 CMP40.EN1
NEXT_R3_MUX_MAIN
  Top 0.61: CMP15.P$14 160.02,787.4 294.64,787.4 CMP40.EN2
R0_HOLD  (1 unrouted)
R0_IS_Z
  Top 0.61: CMP20.IS_ZERO 647.07,31.75 688.34,31.75 688.34,93.34 CMP22.P$5
R0_MSB
  Top 0.61: CMP20.MSB 613.41,29.21 690.88,29.21 690.88,108.58 CMP22.P$1
R1_HOLD  (1 unrouted)
R1_IS_Z
  Top 0.61: CMP21.IS_ZERO 626.75,394.97 707.39,394.97 707.39,89.53 CMP22.P$6
R1_MSB
  Top 0.61: CMP21.MSB 660.4,392.43 704.85,392.43 704.85,360.05 | 704.85,360.05 704.85,104.78 CMP22.P$2 | CMP21.SHIFT_IN 704.85,360.05
R2_HOLD  (1 unrouted)
R2_IS_Z
  Top 0.61: CMP11.IS_ZERO 626.11,641.35 716.28,641.35 716.28,85.72 CMP22.P$7
R2_MSB
  Top 0.61: CMP11.MSB 659.76,638.81 713.74,638.81 | 713.74,638.81 713.74,100.97 CMP22.P$3 | CMP16.SHIFT_IN 713.74,855.98 713.74,638.81
R2_SHIFT_IN
  Top 0.61: CMP11.SHIFT_IN 710.57,607.06 710.57,61.59 782.32,61.59 CMP5.P$1
R3_HOLD  (1 unrouted)
R3_IS_Z
  Top 0.61: CMP16.IS_ZERO 626.75,890.27 726.44,890.27 726.44,81.92 CMP22.P$8
R3_MSB
  Top 0.61: CMP16.MSB 660.4,887.73 723.9,887.73 723.9,97.16 CMP22.P$4
REG_R0  (1 unrouted)
REG_R0_SHIFT  (1 unrouted)
REG_R1  (1 unrouted)
REG_R1_ROTATE  (1 unrouted)
REG_R1_ROTATE_A  (1 unrouted)
REG_R2  (1 unrouted)
REG_R2_LEFT_SHIFTED  (1 unrouted)
REG_R2_LEFT_SHIFTED_A  (1 unrouted)
REG_R2_LEFT_SHIFTED_B  (1 unrouted)
REG_R3  (1 unrouted)
WN_0  (1 unrouted)
WN_1  (1 unrouted)
WN_2  (1 unrouted)
WN_3  (1 unrouted)
WN_3_X  (1 unrouted)
WN_4  (1 unrouted)
(copper drawn outside any net)
  shapes: Top circle x5

### Text on the board
tPlace: General Registers | R3 | Here are the registers R0-R3. / They share the sources Wn / and ADD2. / They have individual shifters to / supprt the complex instructions / (mul, div, sqrt). | Generate some status flags from Wn. | shift_R3 | R3_div_shift | R3_hold | R3_Wn | R3_add2 | R3 | R2 | Wn | R2_shift_in | R2_left_ / shifted | R2_div_shift | R2_hold | R2_Wn | R2_add2 | R2 | ADD2 | R1 | R1_rotate | R1_Wn | R1_add2 | R1_mul | R1_hold | R1 | R0 | Rn_arith_ / flags | Gather flags indicating if register values / are zero, positive or negative. | R0_is_N | R1_is_N | R2_is_N | R3_is_N | R0_is_Z | Generate some status flags from ADD2. | R1_is_Z | R2_is_Z | R3_is_Z | WN_is_N | WN_is_Z | R0_Wn | ADD2_is_Z | R0_add2 | ADD2_LSB | R0_shift_1 | R0_hold | R2_shift_in | 0 | R3_div_shift | R3_hold | R3_Wn | R3_add2 | R2_div_shift | R2_hold | R2_Wn | R2_add2 | R1_Wn | R1_add2 | R1_mul | R1_hold | R0_Wn | R0_add2 | R0_shift_1 | R0 | R0_hold | Rn_control(0) | Rn_control(1)